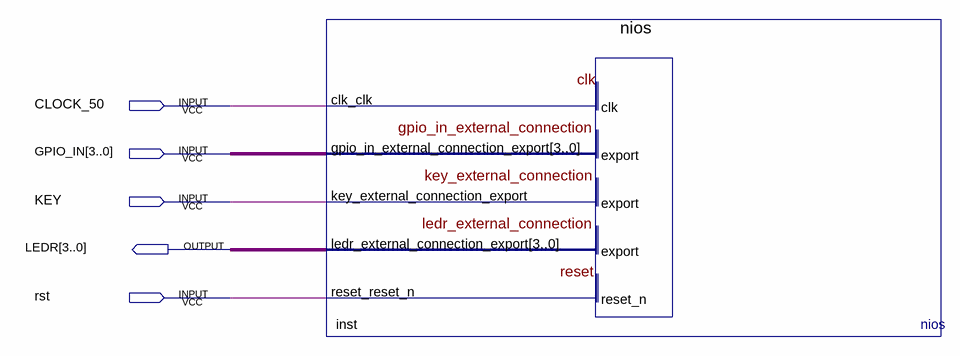
[diagram p0: schematic sheet]
// Quartus schematic FPGA2.bdf as structural Verilog: 1 symbols, 5 pins
module FPGA2 (
  input  CLOCK_50,
  input  [3:0] GPIO_IN,
  input  KEY,
  input  rst,
  output [3:0] LEDR
);

  nios inst (
    .clk_clk(CLOCK_50), .gpio_in_external_connection_export(GPIO_IN), .key_external_connection_export(KEY),
    .reset_reset_n(rst), .ledr_external_connection_export(LEDR));
endmodule
